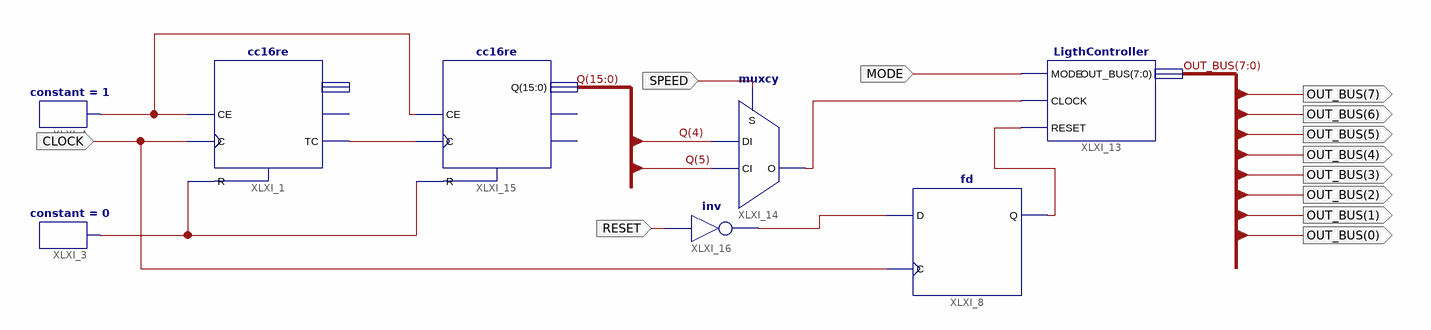
[diagram p0: schematic sheet 1]
// Xilinx ISE schematic TopLevel.sch (spartan3a) as structural Verilog: 8 symbols, 12 ports
module TopLevel (
  input  SPEED,
  input  MODE,
  input  CLOCK,
  input  RESET,
  output [7:0] OUT_BUS
);

  wire XLXN_2, XLXN_23, XLXN_113, XLXN_128, XLXN_130, XLXN_133;
  wire [15:0] Q;

  cc16re XLXI_1 (.C(CLOCK), .CE(XLXN_2), .R(XLXN_130), .TC(XLXN_23));  // open: CEO, Q
  constant #(.CValue("0")) XLXI_3 (.O(XLXN_130));
  constant #(.CValue("1")) XLXI_4 (.O(XLXN_2));
  fd XLXI_8 (.C(CLOCK), .D(XLXN_133), .Q(XLXN_113));
  LigthController XLXI_13 (.MODE(MODE), .CLOCK(XLXN_128), .RESET(XLXN_113), .OUT_BUS(OUT_BUS));
  muxcy XLXI_14 (.CI(Q[5]), .DI(Q[4]), .S(SPEED), .O(XLXN_128));
  cc16re XLXI_15 (.C(XLXN_23), .CE(XLXN_2), .R(XLXN_130), .Q(Q));  // open: CEO, TC
  not XLXI_16 (XLXN_133, RESET);
endmodule
